# EasyEDA Pro project 2230506226.epro

# Schematic Schematic2
Board Name: Board1; Create Date: 2024-11-21; Page Name: P1; Project Name: 16V2_EDA; Schematic Name: Schematic2; Update Date: 2024-11-22; Company: 嘉立创EDA; Page Size: A4; Version: V1.0
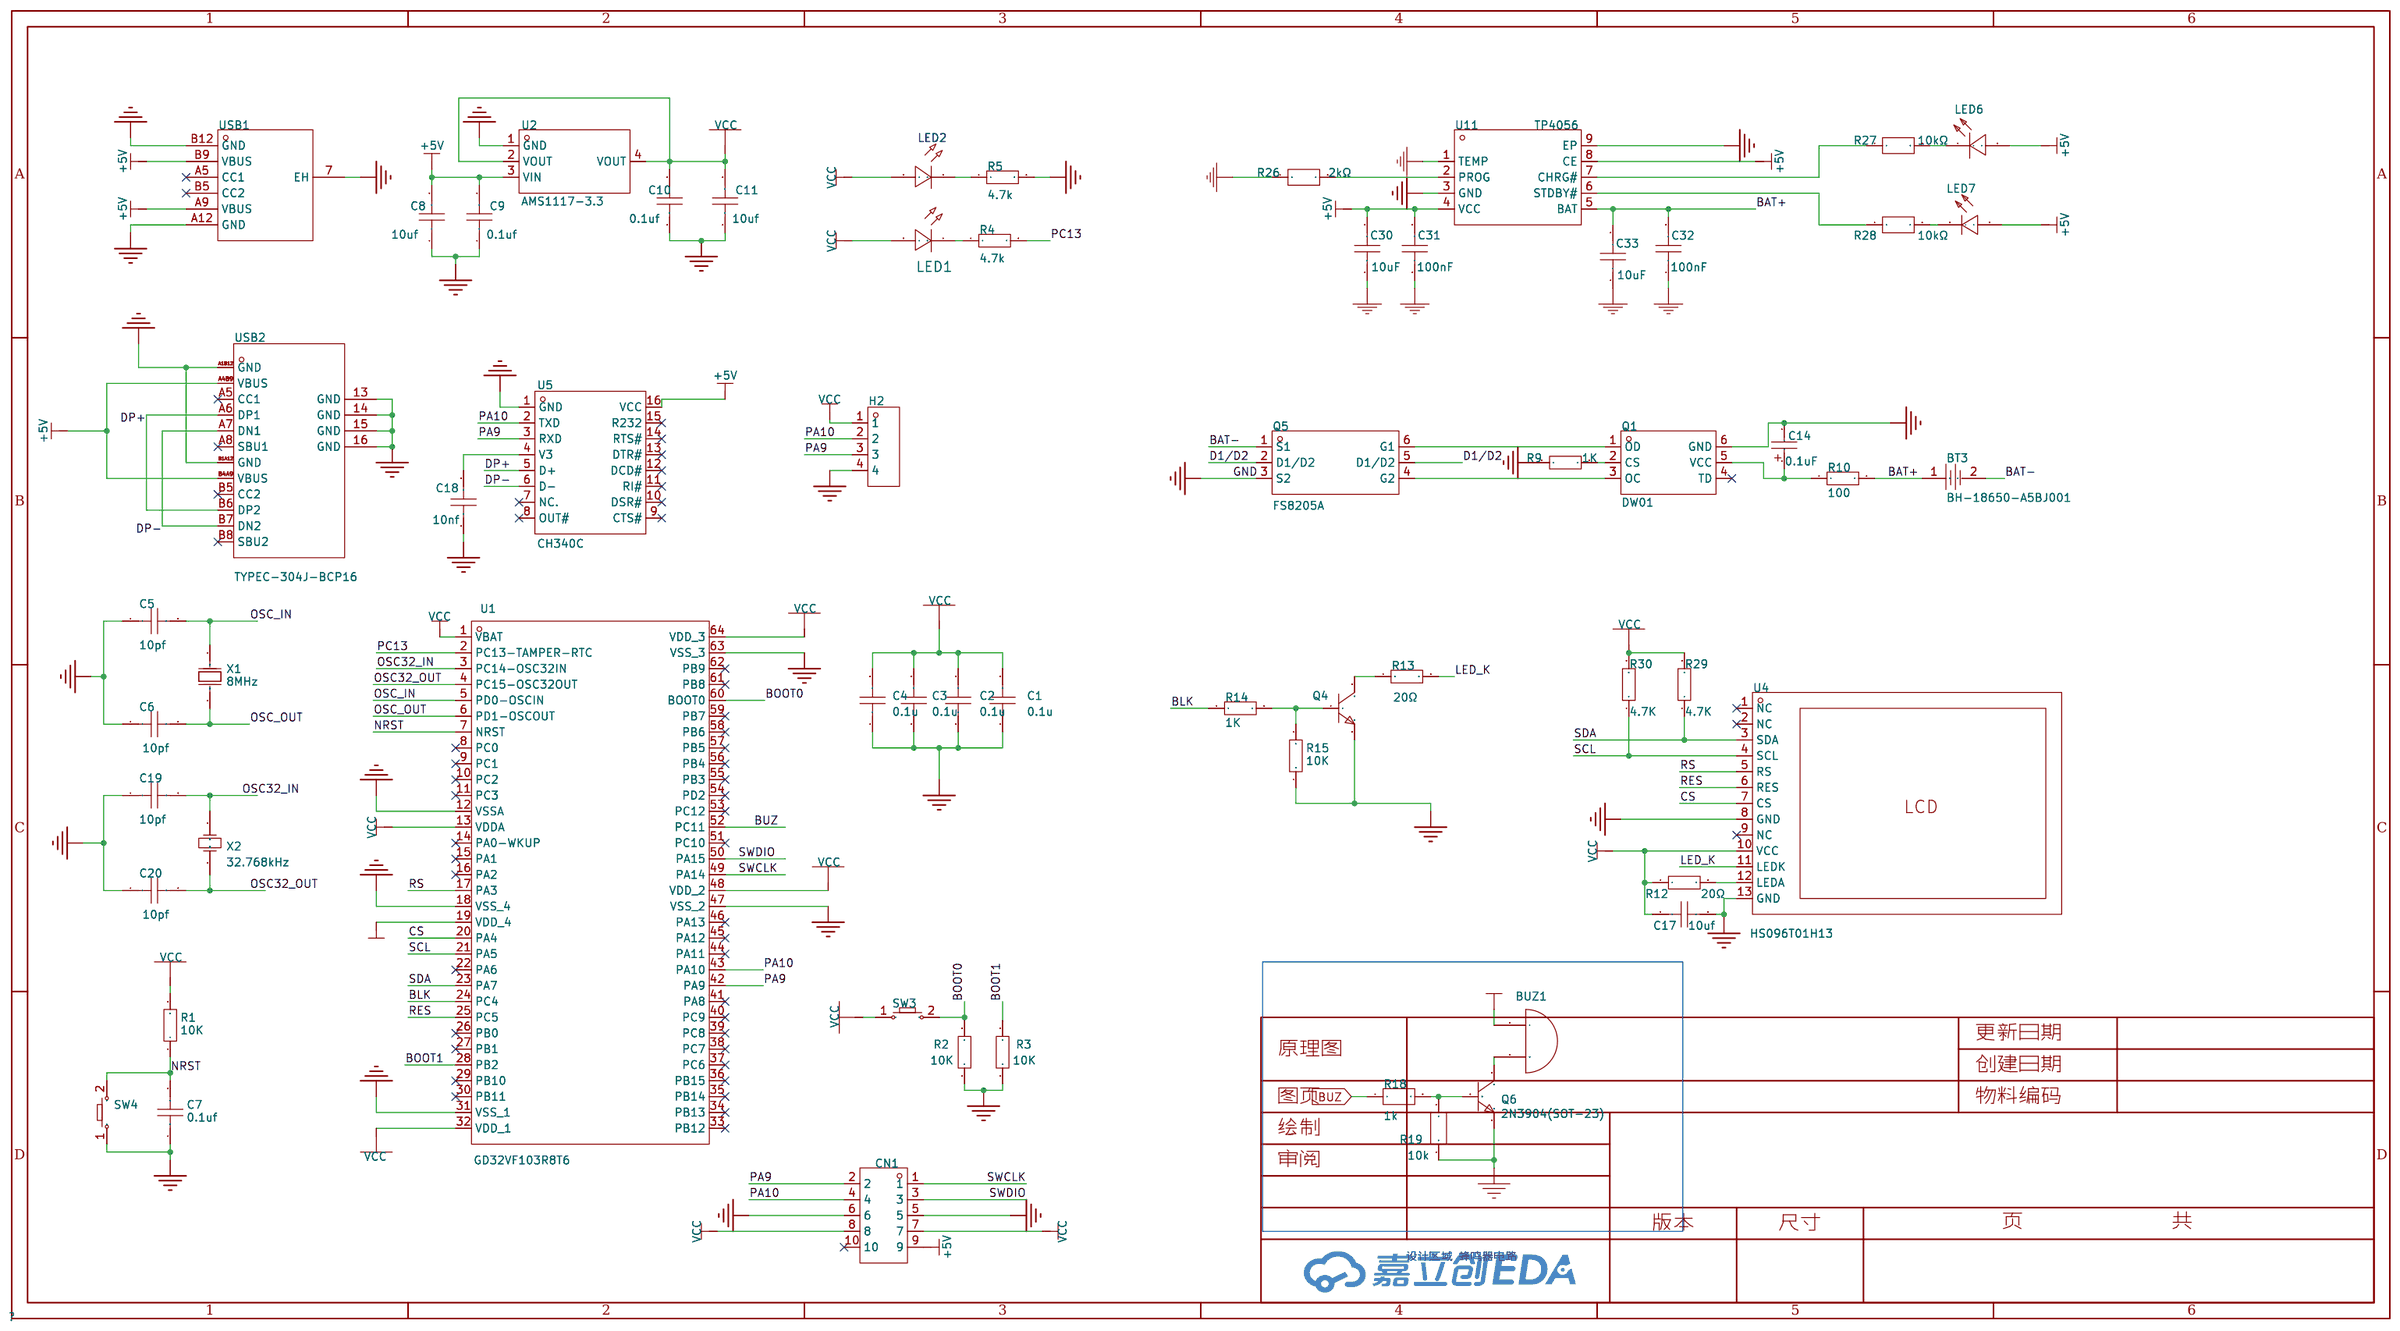
[diagram p0: schematic sheet]

## Parts
BT3  BH-18650-A5BJ001  [BAT-SMD_CR1202]
BUZ1  BUZ1  [BUZ]
C1  0.1u  [C0603]
C2  0.1u  [C0603]
C3  0.1u  [C0603]
C4  0.1u  [C0603]
C5  10pf  [C0603]
C6  10pf  [C0603]
C7  0.1uf  [C0603]
C8  10uf  [C0603]
C9  0.1uf  [C0603]
C10  0.1uf  [C0603]
C11  10uf  [C0603]
C14  0.1uF  [C0603]
C17  10uf  [C0603]
C18  10nf  [C0603]
C19  10pf  [C0603]
C20  10pf  [C0603]
C30  10uF  [C0603]
C31  100nF  [C0603]
C32  100nF  [C0603]
C33  10uF  [C0603]
CN1  ZX-PZ2.54-2-5PZZ  [hdr-th_10p-p2.54-v-m-r2-c5-s2.54]
H2  2.54-1*4P反弯排针  [HDR-TH_4P-P2.54-H-M-W10.4]
LED1  -  [LED_0603]
LED2  -  [LED_0603]
LED6  KT-0603R  [LED0603-RD]
LED7  NCD0603B1  [LED0603-RD]
Q1  DW01  [SOT-23-6_L2.9-W1.6-P0.95-LS2.8-BR]
Q4  -  [S8050_SOT-23]
Q5  FS8205A  [SOT-23-6_L2.9-W1.6-P0.95-LS2.8-BR]
Q6  2N3904(SOT-23)  [sot-23-3_l2.9-w1.3-p1.90-ls2.4-br]
R1  10K  [R0603]
R2  10K  [R0603]
R3  10K  [R0603]
R4  4.7k  [R0603]
R5  4.7k  [R0603]
R9  1K  [R0603]
R10  100  [R0603]
R12  20Ω  [R0603]
R13  20Ω  [R0603]
R14  1K  [R0603]
R15  10K  [R0603]
R18  1k  [R0603]
R19  10k  [R0603]
R26  2kΩ  [R0603]
R27  10kΩ  [R0603]
R28  10kΩ  [R0603]
R29  4.7K  [R0603]
R30  4.7K  [R0603]
SW3  -  [Key_SMD_3x4x2]
SW4  -  [Key_SMD_3x4x2]
U1  GD32VF103R8T6  [LQFP-64_L10.0-W10.0-P0.50-LS12.0-BL]
U2  AMS1117-3.3  [SOT-223-3_L6.5-W3.4-P2.30-LS7.0-BR]
U4  HS096T01H13  [LCD-SMD_HS096T01H13]
U5  CH340C  [SOP-16_L10.0-W3.9-P1.27-LS6.0-BL]
U11  TP4056  [esop-8_l4.9-w3.9-p1.27-ls6.0-bl-ep]
USB1  TYPE-C 6P  [TYPE-C-SMD_TYPE-C-6P]
USB2  TYPEC-304J-BCP16  [USB-C-SMD_TYPEC-304J-BCP16]
X1  8MHz  [HC-49S_L10.8-W4.5-P4.88]
X2  32.768kHz  [CRYSTAL-SMD_L3.2-W1.5]

## Library data of the parts
BT3 = BH-18650-A5BJ001: BHNi DIP 适用电池18650电芯//电池底座/卧式DIP 电池盒/电池座 材质：PP  镀镍 ，; Supplier Part: C5383220; Manufacturer: MYOUNG(美阳); Supplier Footprint: 插件; Datasheet: https://atta.szlcsc.com/upload/public/pdf/source/20230321/F45C04DF2D4E00D187312CBE97BD9F67.pdf; Supplier: LCSC
BUZ1 = BUZ1
C1-C11 C17-C20 = CAP_0603: Supplier Footprint: 0603
C14 = C_Ele_SMD_3x5.4mm: Supplier Footprint: SMD,3x5.4mm
C30 C33 = CL21A106KAYNNNE_C15850: 容值:10uF;精度:±10%;额定电压:25V;材质(温度系数):X5R;; LCSC Part Name: 10uF ±10% 25V; Supplier Part: C15850; Manufacturer: SAMSUNG(三星); Manufacturer Part: CL21A106KAYNNNE; Supplier Footprint: 0805; JLCPCB Part Class: Basic Part; Datasheet: https://atta.szlcsc.com/upload/public/pdf/source/20160218/1457707763339.pdf; Supplier: LCSC; Tolerance: ±10%; Voltage Rated: 25V; Temperature Coefficient: X5R
C31 C32 = CC0603KRX7R9BB104: 容值:100nF;精度:±10%;额定电压:50V;材质(温度系数):X7R;; LCSC Part Name: 100nF ±10% 50V; Supplier Part: C14663; Manufacturer: YAGEO(国巨); Supplier Footprint: 0603; JLCPCB Part Class: 基础库; Datasheet: https://atta.szlcsc.com/upload/public/pdf/source/20180910/C282072_33301C7F631E79921B82A8DAC6BCC5B3.pdf; Supplier: LCSC; Tolerance: ±10%; Voltage Rated: 50V; Temperature Coefficient: X7R
CN1 = ZX-PZ2.54-2-5PZZ: 插针结构:2x5P;间距:2.54mm;行距:2.54mm;圆针/方针:方针;安装类型:直插;排数:双排;总PIN位数:10P;额定电流:3A;额定电压:1kV;配合针长度:6mm;塑高:2.5mm;端接针长度:3mm;触头材质:黄铜;触头镀层:金;工作温度范围:-40℃~+105℃;焊接温度(最大值):-;颜色:黑色;; LCSC Part Name: 2x5P 间距:2.54mm 方针 直插; Supplier Part: C7501276; Manufacturer: Megastar(兆星); Supplier Footprint: 插件,P=2.54mm; JLCPCB Part Class: Extended Part; Datasheet: https://atta.szlcsc.com/upload/public/pdf/source/20231122/7DD2FA5A7FDBC10CDDB6051CB6BC6AD1.pdf; Supplier: LCSC; Pin Structure: 2x5P; Pitch: 2.54mm; Row Spacing: 2.54mm; Circluar Pins/Square Pins: 方针; Mounting Type: 直插; Number of Rows: 双排; Number of Pins: 10P; Current Rating (Max): 3A; Voltage Rating (Max): 1kV; Length of Mating Pin: 6mm; Insulation Height: 2.5mm; Length of End Connection Pin: 3mm; Contact Material: 黄铜; Contact Plating: 金; Operating Temperature Range: -40℃~+105℃; Color: 黑色; Check: false
H2 = 2.54-1*4P反弯排针: 插针结构:1x4P;间距:2.54mm;行距:-;圆针/方针:方针;安装类型:弯插;排数:单排;总PIN位数:4P;额定电流:3A;额定电压:-;配合针长度:6mm;塑高:-;端接针长度:-;触头材质:-;触头镀层:-;工作温度范围:-55℃~+105℃;颜色:黑色;; LCSC Part Name: 间距:2.54mm 1x4P 弯插 方针; Supplier Part: C91552; Manufacturer: BOOMELE(博穆精密); Supplier Footprint: 弯插,P=2.54mm; JLCPCB Part Class: 扩展库; Datasheet: https://atta.szlcsc.com/upload/public/pdf/source/20190508/C74252_03DDEC4696EE17172E44B96636392962.pdf; Supplier: LCSC; Pin Structure: 1x4P; Pitch: 2.54mm; Circluar Pins/Square Pins: 方针; Mounting Type: 弯插; Number of Rows: 单排; Number of Pins: 4P; Current Rating (Max): 3A; Length of Mating Pin: 6mm; Operating Temperature Range: -55℃~+105℃; Color: 黑色
LED1 = LED_0603-R: Supplier Footprint: 0603
LED2 = LED_0603-G: Supplier Footprint: 0603
LED6 = KT-0603R: Supplier: LCSC; Manufacturer: KENTO; Supplier Part: C2286; JLCPCB Part Class: Basic Part
LED7 = NCD0603B1: 发光颜色:蓝色;正向电压(VF):2.6V~3.6V;功率:72mW;正向电流:10mA;主波长:463nm~475nm;透镜颜色:无色透明透镜;发光强度:80mcd~220mcd;发光角度:130°;工作温度:-30℃~+85℃;; Supplier Part: C84266; Manufacturer: 国星光电; Supplier Footprint: 0603; JLCPCB Part Class: Extended Part; Datasheet: https://atta.szlcsc.com/upload/public/pdf/source/20200820/C84266_6A3CDBEFA72C6CAD68EDA53474ADAE6C.pdf; Supplier: LCSC; Emitted Color: 蓝色; Forward Voltage (VF): 2.6V~3.6V; Power Dissipation: 72mW; Forward Current: 10mA; Dominant Wavelength: 463nm~475nm; Lens Color: 无色透明透镜; Luminous Intensity: 80mcd~220mcd; Viewing Angle: 130°; Operating Temperature: -30℃~+85℃
Q1 = DW01_C181096: Supplier Part: C181096; Manufacturer: Hottech(合科泰); Supplier Footprint: SOT-23-6; Datasheet: https://atta.szlcsc.com/upload/public/pdf/source/20231007/94AC323C2B651AEA18C7FC8F0156E5A9.pdf; Supplier: LCSC
Q4 = S8050_SOT_NPN: Supplier Footprint: SOT-23
Q5 = FS8205A: 类型:2个N沟道;漏源电压(Vdss):20V;连续漏极电流(Id):6A;功率(Pd):1.5W;导通电阻(RDS(on)@Vgs,Id):19.5mΩ@4.5V,3A;阈值电压(Vgs(th)@Id):700mV@250uA;; LCSC Part Name: 2个N沟道 耐压:20V 电流:6A; Supplier Part: C2830320; Manufacturer: TECH PUBLIC(台舟); Supplier Footprint: SOT-23-6; JLCPCB Part Class: 扩展库; Datasheet: https://atta.szlcsc.com/upload/public/pdf/source/20210810/F53B6D4E8755A1F8E11BAF814CE98E6A.pdf; Supplier: LCSC; Type: 2个N沟道; Drain Source Voltage (Vdss): 20V; Continuous Drain Current (Id): 6A; Power Dissipation (Pd): 1.5W; Drain Source On Resistance (RDS(on)@Vgs,Id): 19.5mΩ@4.5V,3A; Gate Threshold Voltage (Vgs(th)@Id): 700mV@250uA; Total Gate Charge (Qg@Vgs): 5.7nC@10V; Input Capacitance (Ciss@Vds): 466pF@10V; Reverse Transfer Capacitance (Crss@Vds): 58pF@10V; Operating Temperature: -55℃~+150℃@(Tj)
Q6 = 2n3904S-RTK/PS: Supplier: LCSC; Manufacturer: KEC; Supplier Part: C18536; Paste Type: SOT-23
R1-R5 R9 R10 R12-R15 R29 R30 = Res_0603: Supplier Footprint: 0603
R18 = 1k
R19 = 10k
R26 = 0603WAF2001T5E: 电阻类型:厚膜电阻;阻值:2kΩ;精度:±1%;功率:100mW;最大工作电压:75V;温度系数:±100ppm/℃;; LCSC Part Name: 2kΩ ±1% 100mW 厚膜电阻; Supplier Part: C22975; Manufacturer: UNI-ROYAL(厚声); Supplier Footprint: 0603; JLCPCB Part Class: Basic Part; Datasheet: https://atta.szlcsc.com/upload/public/pdf/source/20200306/C422600_1E6D84923E4A46A82E41ADD87F860B5C.pdf; Supplier: LCSC; Type: 厚膜电阻; Tolerance: ±1%; Power(Watts): 100mW; Overload Voltage (Max): 75V; Temperature Coefficient: ±100ppm/℃; Operating Temperature Range: -55℃~+155℃
R27 R28 = 0603WAF1002T5E: 电阻类型:厚膜电阻;阻值:10kΩ;精度:±1%;功率:100mW;最大工作电压:75V;温度系数:±100ppm/℃;; LCSC Part Name: 厚膜电阻 10kΩ ±1% 100mW; Supplier Part: C25804; Manufacturer: UNI-ROYAL(厚声); Supplier Footprint: 0603; JLCPCB Part Class: Basic Part; Datasheet: https://atta.szlcsc.com/upload/public/pdf/source/20200306/C422600_1E6D84923E4A46A82E41ADD87F860B5C.pdf; Supplier: LCSC; Type: 厚膜电阻; Tolerance: ±1%; Power(Watts): 100mW; Overload Voltage (Max): 75V; Temperature Coefficient: ±100ppm/℃; Operating Temperature Range: -55℃~+155℃
SW3 SW4 = Key_SMD_3x4x2: Supplier Footprint: SMD
U1 = GD32VF103R8T6: CPU内核:RISC-V;程序存储容量:64KB;RAM总容量:20KB;GPIO端口数量:51;工作电压范围:-;CPU最大主频:108MHz;程序存储器类型:FLASH;; Supplier Part: C5178402; Manufacturer: GigaDevice(兆易创新); Supplier Footprint: LQFP-64(10x10); Supplier: LCSC; CPU Core: RISC-V; Program Storage Size: 64KB; RAM Size: 20KB; GPIO Ports Number: 51; CPU Maximum Speed: 108MHz; Program Memory Type: FLASH; ADC (Bit): 12bit; DAC (Bit): 12bit; 16Bit Timer: 7; CAN: 2; UART/USART: 5; I2C: 2; I2S: 2; SPI: 3; Universal Serial Bus: 有; Peripheral/Function: 看门狗；RTC实时时钟; Watchdog: 有; Real-Time Clock: 有
U2 = AMS1117-3.3_C6186: 输出类型:固定;最大输入电压:-;输出电压:3.3V;最大输出电流:1A;电源纹波抑制比(PSRR):72dB@(120Hz);输出极性:正极;; LCSC Part Name: 输出3.3V 1A; Supplier Part: C6186; Manufacturer: AMS; Supplier Footprint: SOT-223; JLCPCB Part Class: 基础库; Datasheet: https://atta.szlcsc.com/upload/public/pdf/source/20180727/C6186_7A095716F0823C02F1997A905E26C086.pdf; Supplier: LCSC; Output Type: 固定; Output Voltage: 3.3V; MAX Output Current: 1A; Power Supply Rejection Ratio (PSRR): 72dB@(120Hz); Dropout Voltage: 1.3V@(800mA); Output Polarity: 正极; Number of Outputs: 1
U4 = HS096T01H13: 主控芯片:ST7735;尺寸(inch):0.96;; LCSC Part Name: 0.96寸 0.96寸800x160(RGB)彩色SPI串口TFT液晶显示屏; Supplier Part: C18198246; Manufacturer: HS(汉昇); Datasheet: https://atta.szlcsc.com/upload/public/pdf/source/20230921/67AD52EDFD5E8BFFA1AE424F3A3F761A.pdf; Supplier: LCSC; Main Control Chip: ST7735; Size: 0.96; Operating Temperature: -20℃~+70℃
U5 = CH340C: 应用功能:收发器;接口协议:USB 2.0;数据速率:2Mbps;; LCSC Part Name: CH340C USB转串口芯片 CH340; Supplier Part: C84681; Manufacturer: WCH(南京沁恒); Supplier Footprint: SOP-16; JLCPCB Part Class: 扩展库; Datasheet: https://atta.szlcsc.com/upload/public/pdf/source/20200819/C84681_ADBED554CE321879DBD6B1D06488689C.pdf; Supplier: LCSC; Applications Function: 收发器; Protocol: USB 2.0; Supply Voltage: 3.3V；5V; Data Rate: 2Mbps
U11 = TP4056_C725790: Supplier: LCSC; Supplier Part: C725790; Manufacturer: UMW(友台半导体); JLCPCB Part Class: Extended Part
USB1 = TYPE-C 6P: 连接器类型:Type-C;标准:-;公母:母;端口数量:1;触点数量:6P;安装方式:卧贴;额定电流 - 电源:-;工作温度范围:-40℃~+85℃;; LCSC Part Name: Type-C 母 卧贴; Supplier Part: C456012; Manufacturer: SHOU HAN(首韩); Supplier Footprint: SMD; JLCPCB Part Class: 扩展库; Datasheet: https://atta.szlcsc.com/upload/public/pdf/source/20201203/C456012_B13F72044DF846EDBE9BDD0D1D3CD166.pdf; Supplier: LCSC; Connector Type: Type-C; Gender: 母; Number of Ports: 1; Number of Contacts: 6P; Mounting Style: 卧贴; Operating Temperature Range: -40℃~+85℃
USB2 = TYPEC-304J-BCP16: 连接器类型:Type-C;标准:USB 3.1;公母:母;端口数量:1;触点数量:16P;安装方式:卧贴;额定电流 - 电源:5A;工作温度范围:-40℃~+85℃;焊接温度(最大值):260℃;; LCSC Part Name: Type-C 母 卧贴; Supplier Part: C2835315; Manufacturer: XUNPU(讯普); Supplier Footprint: SMD; Datasheet: https://atta.szlcsc.com/upload/public/pdf/source/20210528/C2835315_A76BD3CF9329D12B6041421AD23BFD66.pdf; Supplier: LCSC; Connector Type: Type-C; Standard: USB 3.1; Gender: 母; Number of Ports: 1; Number of Contacts: 16P; Mounting Style: 卧贴; Current Rating - Power (Max): 5A; Operating Temperature Range: -40℃~+85℃; Soldering Temperature(Max): 260℃
X1 = X49SM8MSD2SC: 晶振类型:贴片晶振;频率:8MHz;常温频差:±20ppm;外接负载电容:20pF;频率稳定度(全温):±30ppm;; LCSC Part Name: 8MHz ±20ppm 20pF; Supplier Part: C12674; Manufacturer: YXC(扬兴晶振); Supplier Footprint: HC-49S-SMD; JLCPCB Part Class: 基础库; Datasheet: https://atta.szlcsc.com/upload/public/pdf/source/20240329/3EBF42EBCAB50CA65B6FA9D7CFA1955A.pdf; Supplier: LCSC; Crystal Type: 贴片晶振; Normal temperature Frequency Tolerance: ±20ppm; External load capacitor: 20pF; Frequency Stability(Full temperature range): ±30ppm; Operating Temperature: -20℃~+70℃
X2 = X308032768KGB2SC: 晶振类型:直插晶振;频率:32.768kHz;常温频差:±10ppm;外接负载电容:12.5pF;频率稳定度(全温):-;; LCSC Part Name: 32.768kHz ±10ppm 12.5pF YT-38; Supplier Part: C52082; Manufacturer: YXC(扬兴晶振); Supplier Footprint: DT-38; JLCPCB Part Class: Extended Part; Datasheet: https://atta.szlcsc.com/upload/public/pdf/source/20240329/231E1A1EB7C875CD193DBE6664A3DE3A.pdf; Supplier: LCSC; Crystal Type: 直插晶振; Normal temperature Frequency Tolerance: ±10ppm; External load capacitor: 12.5pF; Operating Temperature: -20℃~+70℃

## Nets
+5V: C8.2 C9.2 C30.2 C31.2 CN1.9 LED6.2(A) LED7.2(+) U2.3(VIN) U5.16(VCC) U11.4(VCC) U11.8(CE) USB1.A9(VBUS) USB1.B9(VBUS) USB2.A4B9(VBUS) USB2.B4A9(VBUS)
GND: C1.1 C2.1 C3.1 C4.1 C5.1 C6.1 C7.1 C8.1 C9.1 C10.1 C11.1 C14.2 C17.2 C18.1 C19.1 C20.1 C30.1 C31.1 C32.1 C33.1 CN1.5 CN1.6 H2.4 Q1.6(GND) Q4.2 Q5.3(S2) Q6.1(E) R2.1 R3.1 R5.2 R9.1 R15.1 R19.2 R26.1 SW4.1 U1.12(VSSA) U1.18(VSS_4) U1.31(VSS_1) U1.47(VSS_2) U1.63(VSS_3) U2.1(GND) U4.8(GND) U4.13(GND) U5.1(GND) U11.1(TEMP) U11.3(GND) U11.9(EP) USB1.7(EH) USB1.A12(GND) USB1.B12(GND) USB2.13(GND) USB2.14(GND) USB2.15(GND) USB2.16(GND) USB2.A1B12(GND) USB2.B1A12(GND)
VCC: BUZ1.1(A) C1.2 C2.2 C3.2 C4.2 C10.2 C11.2 C17.1 CN1.7 CN1.8 H2.1 LED1.2(A) LED2.2(A) R1.2 R12.1 R29.2 R30.2 SW3.1 U1.1(VBAT) U1.13(VDDA) U1.19(VDD_4) U1.32(VDD_1) U1.48(VDD_2) U1.64(VDD_3) U2.2(VOUT) U2.4(VOUT) U4.10(VCC)
BAT+: BT3.1 C32.2 C33.2 R10.2 U11.5(BAT)
BAT-: BT3.2 Q5.1(S1)
BLK: R14.1 U1.24(PC4)
BOOT0: R2.2 SW3.2 U1.60(BOOT0)
BOOT1: R3.2 U1.28(PB2)
BUZ: R18.1 U1.52(PC11)
CS: U1.20(PA4) U4.7(CS)
D1/D2: Q5.2(D1/D2) Q5.5(D1/D2)
DP+: U5.5(D+) USB2.A6(DP1) USB2.B6(DP2)
DP-: U5.6(D-) USB2.A7(DN1) USB2.B7(DN2)
LED_K: R13.2 U4.11(LEDK)
NRST: C7.2 R1.1 SW4.2 U1.7(NRST)
OSC32_IN: C19.2 U1.3(PC14-OSC32IN) X2.1(OSC1)
OSC32_OUT: C20.2 U1.4(PC15-OSC32OUT) X2.2(OSC2)
OSC_IN: C5.2 U1.5(PD0-OSCIN) X1.1(OSC1)
OSC_OUT: C6.2 U1.6(PD1-OSCOUT) X1.2(OSC2)
PA9: CN1.2 H2.3 U1.42(PA9) U5.3(RXD)
PA10: CN1.4 H2.2 U1.43(PA10) U5.2(TXD)
PC13: R4.2 U1.2(PC13-TAMPER-RTC)
RES: U1.25(PC5) U4.6(RES)
RS: U1.17(PA3) U4.5(RS)
SCL: R30.1 U1.21(PA5) U4.4(SCL)
SDA: R29.1 U1.23(PA7) U4.3(SDA)
SWCLK: CN1.1 U1.49(PA14)
SWDIO: CN1.3 U1.50(PA15)
$1N3244: LED1.1(C) R4.1
$1N3260: LED2.1(C) R5.1
$1N3280: Q1.2(CS) R9.2
$1N3281: C14.1 Q1.5(VCC) R10.1
$1N3299: R12.2 U4.12(LEDA)
$1N3320: Q4.3 R13.1
$1N3321: Q4.1 R14.2 R15.2
$1N3342: C18.2 U5.4(V3)
$1N3364: R26.2 U11.2(PROG)
$1N3367: R27.1 U11.7(CHRG#)
$1N3368: LED6.1(K) R27.2
$1N3369: LED7.1(-) R28.2
$1N3370: R28.1 U11.6(STDBY#)
$1N3387: Q1.1(OD) Q5.6(G1)
$1N3388: Q1.3(OC) Q5.4(G2)
$1N22463: Q6.2(B) R18.2 R19.1
$1N22485: BUZ1.2(B) Q6.3(C)

Not connected (* = marked no-connect by the designer): CN1 10*; Q1 4(TD)*; U1 8(PC0)* 9(PC1)* 10(PC2)* 11(PC3)* 14(PA0-WKUP)* 15(PA1)* 16(PA2)* 22(PA6)* 26(PB0)* 27(PB1)* 29(PB10)* 30(PB11)* 33(PB12)* 34(PB13)* 35(PB14)* 36(PB15)* 37(PC6)* 38(PC7)* 39(PC8)* 40(PC9)* 41(PA8)* 44(PA11)* 45(PA12)* 46(PA13)* 51(PC10)* 53(PC12)* 54(PD2)* 55(PB3)* 56(PB4)* 57(PB5)* 58(PB6)* 59(PB7)* 61(PB8)* 62(PB9)*; U4 1(NC)* 2(NC)* 9(NC)*; U5 7(NC.)* 8(OUT#)* 9(CTS#)* 10(DSR#)* 11(RI#)* 12(DCD#)* 13(DTR#)* 14(RTS#)* 15(R232)*; USB1 A5(CC1)* B5(CC2)*; USB2 A5(CC1)* A8(SBU1)* B5(CC2)* B8(SBU2)*

## Notes on the sheet
- 设计区域 蜂鸣器电路

# Board PCB
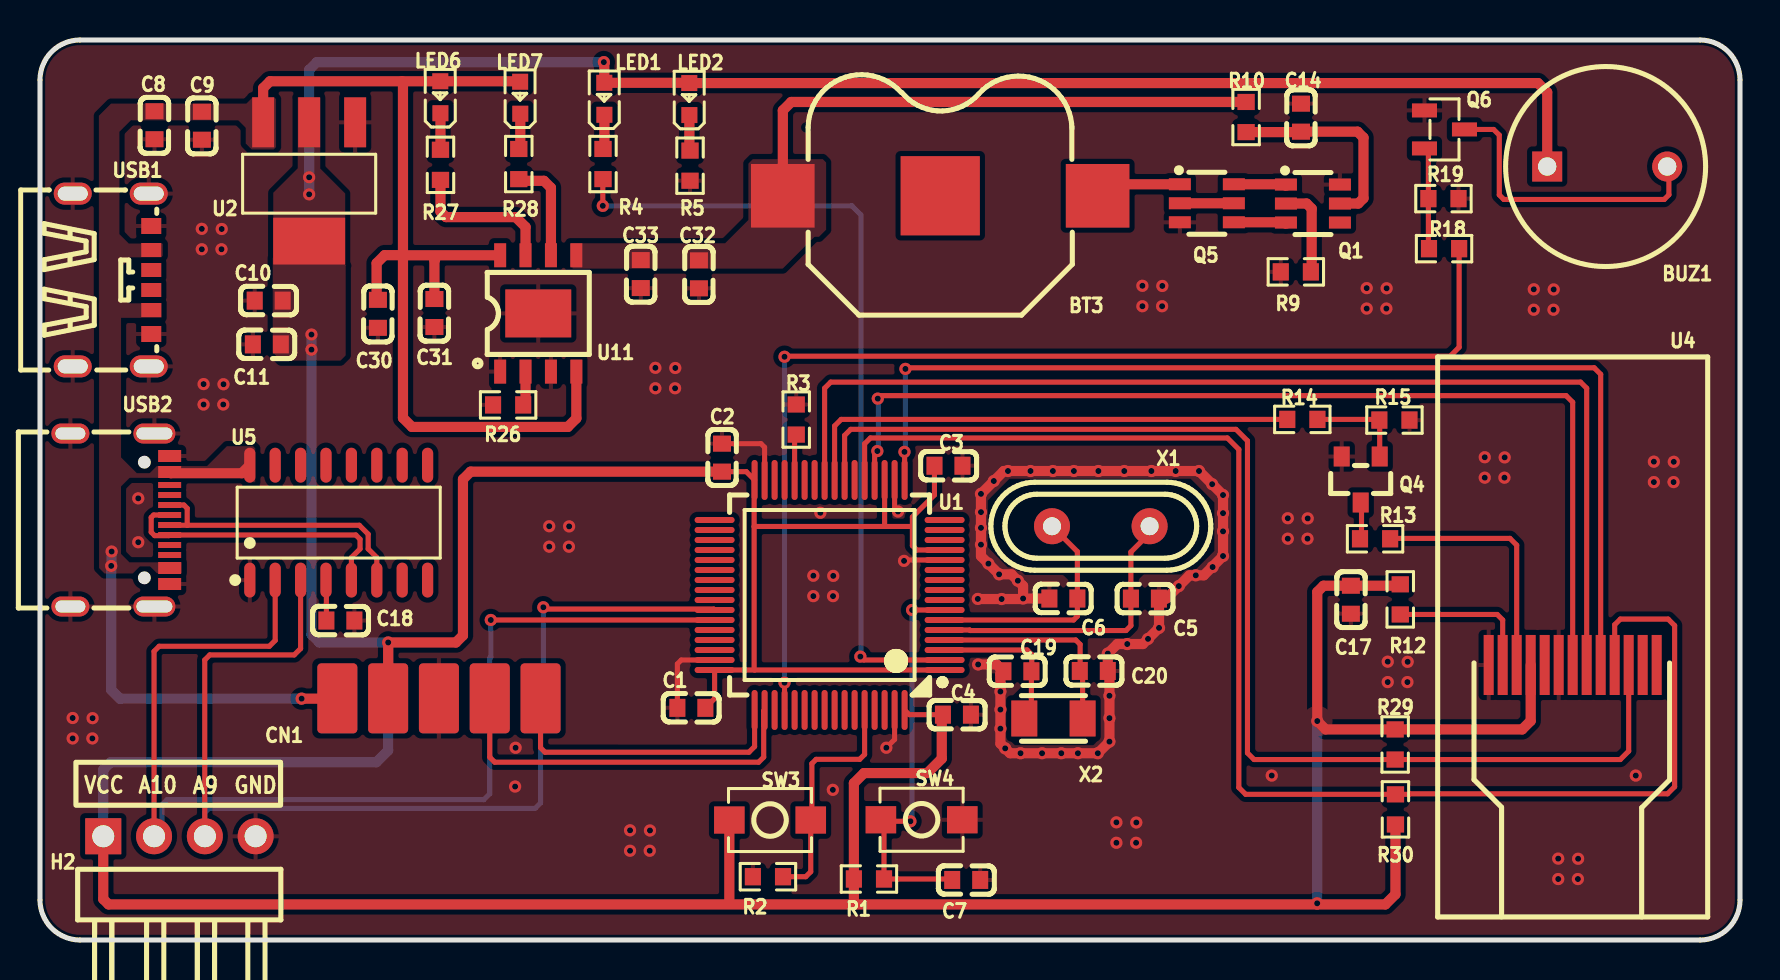
[diagram p1: board, top side]
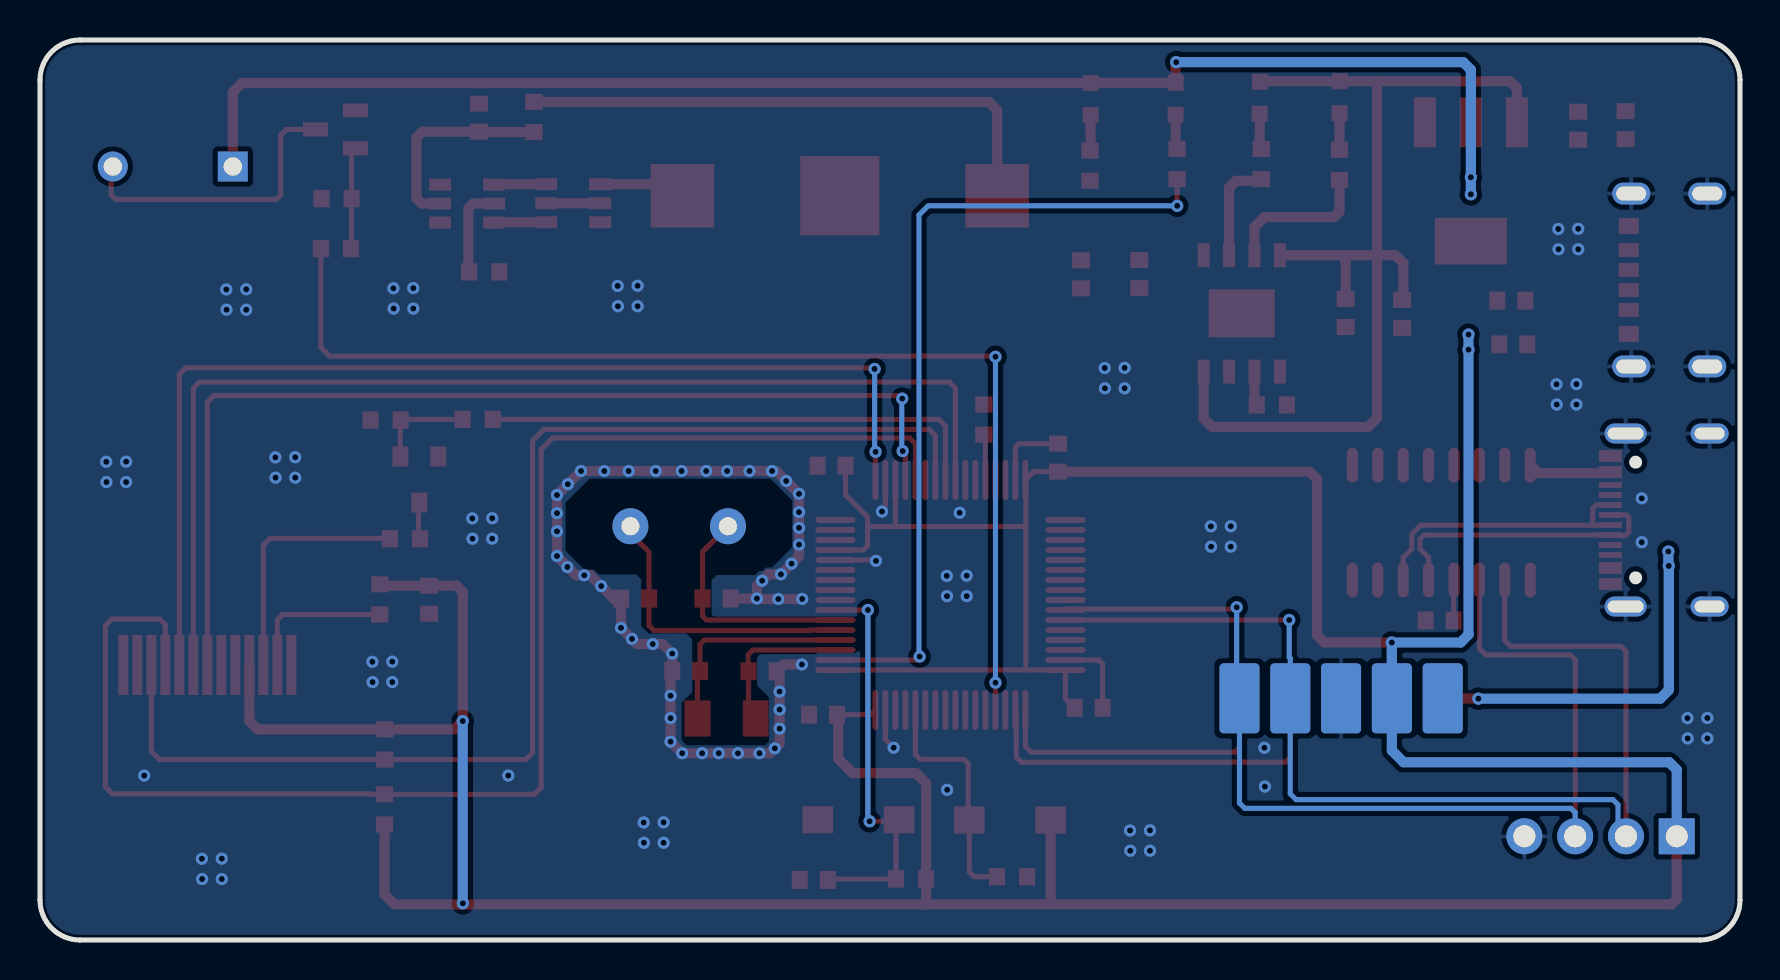
[diagram p2: board, bottom side, seen from below]

Outline 85 x 45 mm; copper layers: Top Layer, Bottom Layer. Coordinates in mm from the lower left corner of the outline.
Outline path: 0,43 0,2 arc(0.59,0.59) 2,0 83,0 arc(84.41,0.59) 85,2 85,43 arc(84.41,44.41) 83,45 2,45 arc(0.59,44.41) 0,43
Stack: Top Layer 0.035mm / Dielectric1 1.51mm FR4 er 4.5 / Bottom Layer 0.035mm

## Design rules (mm)
net DP+: usb
net DP-: usb
template: 自定义配置
spacing copperThickness1oz (default): track to track 0.178, other pairs 0.152 to 0.203
spacing copperThickness2oz: track to track 0.203, other pairs 0.152 to 0.3
track width copperThickness1oz (default): min 0.254, default 0.254, max 2.54
track width pwr: min 0.254, default 0.508, max 2.54
differential pair differentialPair (default): width min 0.127, default 0.254, max 2.54; gap min 0.152, default 0.152
via viaSize (default): diameter min 0.61, default 0.61, max 10; hole min 0.305, default 0.305, max 6.299
net BAT- uses pwr
net BAT+ uses pwr
net VCC uses pwr
net GND uses pwr
net +5V uses pwr

## Placement (name value [footprint] x y rotation side)
BT3  BH-18650-A5BJ001  [BAT-SMD_CR1202]  45.01 37.21 0 top
BUZ1  BUZ1  [BUZ]  78.28 35.5 0 top
C1  0.1u  [C0603]  32.57 11.61 0 top
C2  0.1u  [C0603]  34.1 24.12 270 top
C3  0.1u  [C0603]  45.42 23.71 180 top
C4  0.1u  [C0603]  45.85 11.27 180 top
C5  10pf  [C0603]  55.25 17.07 180 top
C6  10pf  [C0603]  51.17 17.07 0 top
C7  0.1uf  [C0603]  46.31 3 180 top
C8  10uf  [C0603]  5.72 40.74 90 top
C9  0.1uf  [C0603]  8.09 40.71 90 top
C10  0.1uf  [C0603]  11.44 31.97 0 top
C11  10uf  [C0603]  11.34 29.78 0 top
C14  0.1uF  [C0603]  63.05 41.12 90 top
C17  10uf  [C0603]  65.54 17.01 270 top
C18  10nf  [C0603]  15.02 15.97 180 top
C19  10pf  [C0603]  48.87 13.44 0 top
C20  10pf  [C0603]  52.69 13.45 180 top
C30  10uF  [C0603]  16.89 31.31 90 top
C31  100nF  [C0603]  19.72 31.35 90 top
C32  100nF  [C0603]  32.95 33.28 90 top
C33  10uF  [C0603]  30.04 33.3 90 top
CN1  ZX-PZ2.54-2-5PZZ  [hdr-th_10p-p2.54-v-m-r2-c5-s2.54]  19.95 5.25 0 top
H2  2.54-1*4P反弯排针  [HDR-TH_4P-P2.54-H-M-W10.4]  6.97 5.19 0 top
LED1  -  [LED_0603]  28.21 42.11 90 top
LED2  -  [LED_0603]  32.46 42.1 90 top
LED6  KT-0603R  [LED0603-RD]  20.02 42.14 90 top
LED7  NCD0603B1  [LED0603-RD]  24.01 42.11 90 top
Q1  DW01  [SOT-23-6_L2.9-W1.6-P0.95-LS2.8-BR]  63.65 36.82 180 top
Q4  -  [S8050_SOT-23]  66.16 23.03 90 top
Q5  FS8205A  [SOT-23-6_L2.9-W1.6-P0.95-LS2.8-BR]  58.34 36.84 180 top
Q6  2N3904(SOT-23)  [sot-23-3_l2.9-w1.3-p1.90-ls2.4-br]  70.22 40.53 180 top
R1  10K  [R0603]  41.45 3.05 180 top
R2  10K  [R0603]  36.4 3.17 0 top
R3  10K  [R0603]  37.81 26.02 270 top
R4  4.7k  [R0603]  28.15 38.8 270 top
R5  4.7k  [R0603]  32.5 38.72 270 top
R9  1K  [R0603]  62.79 33.41 0 top
R10  100  [R0603]  60.3 41.15 90 top
R12  20Ω  [R0603]  68.01 17.03 270 top
R13  20Ω  [R0603]  66.75 20.06 0 top
R14  1K  [R0603]  63.12 26.03 0 top
R15  10K  [R0603]  67.72 26 180 top
R18  1k  [R0603]  70.2 34.57 180 top
R19  10k  [R0603]  70.17 37.07 0 top
R26  2kΩ  [R0603]  23.41 26.75 0 top
R27  10kΩ  [R0603]  20.02 38.76 90 top
R28  10kΩ  [R0603]  23.94 38.8 90 top
R29  4.7K  [R0603]  67.76 9.78 90 top
R30  4.7K  [R0603]  67.77 6.53 270 top
SW3  -  [Key_SMD_3x4x2]  36.5 6 0 top
SW4  -  [Key_SMD_3x4x2]  44.08 6.01 180 top
U1  GD32VF103R8T6  [LQFP-64_L10.0-W10.0-P0.50-LS12.0-BL]  39.48 17.25 90 top
U2  AMS1117-3.3  [SOT-223-3_L6.5-W3.4-P2.30-LS7.0-BR]  13.46 37.91 90 top
U4  HS096T01H13  [LCD-SMD_HS096T01H13]  76.63 13.75 270 top
U5  CH340C  [SOP-16_L10.0-W3.9-P1.27-LS6.0-BL]  14.94 20.87 0 top
U11  TP4056  [esop-8_l4.9-w3.9-p1.27-ls6.0-bl-ep]  24.91 31.33 0 top
USB1  TYPE-C 6P  [TYPE-C-SMD_TYPE-C-6P]  3.6 33 270 top
USB2  TYPEC-304J-BCP16  [USB-C-SMD_TYPEC-304J-BCP16]  4 21 270 top
X1  8MHz  [HC-49S_L10.8-W4.5-P4.88]  53.04 20.69 180 top
X2  32.768kHz  [CRYSTAL-SMD_L3.2-W1.5]  50.67 11.08 0 top

## Footprints (pads in the part's own frame, mm; a bottom-side part is the same pattern mirrored in y, then rotated)
BAT-SMD_CR1202
  rect 3.18x3.18 smd: 1(-7.87,0) 2(7.87,0)
  rect 3.96x3.96 smd: 3(0,0)
BUZ
  rect 1.5x1.5 hole 0.914: 1(-2.921,3.175)
  round 1.5 hole 0.914: 2(3.079,3.175)
C0603
  rect 0.8x0.9 smd: 1(-0.7,0) 2(0.7,0)
CRYSTAL-SMD_L3.2-W1.5
  rect 1.3x1.8 smd: 1(-1.458,0) 2(1.458,0)
esop-8_l4.9-w3.9-p1.27-ls6.0-bl-ep
  rect 0.6x1.2 smd: 1(-1.905,-2.909) 2(-0.635,-2.909) 3(0.635,-2.909) 4(1.905,-2.909) 5(1.905,2.909) 6(0.635,2.909) 7(-0.635,2.909) 8(-1.905,2.909)
  rect 3.3x2.4 smd: 9(0,0)
HC-49S_L10.8-W4.5-P4.88
  round 1.8 hole 0.9: 1(-2.44,0) 2(2.44,0)
HDR-TH_4P-P2.54-H-M-W10.4
  rect 1.8x1.8 hole 1.1: 1(-3.81,0)
  round 1.8 hole 1.1: 2(-1.27,0) 3(1.27,0) 4(3.81,0)
hdr-th_10p-p2.54-v-m-r2-c5-s2.54
  rrect 2x3.5 smd: 1(5.08,6.832) 3(2.54,6.832) 5(0,6.832) 7(-2.54,6.832) 9(-5.08,6.832)
  rrect 2x3.5 smd far side: 2(5.08,6.832) 4(2.54,6.832) 6(0,6.832) 8(-2.54,6.832) 10(-5.08,6.832)
Key_SMD_3x4x2
  rect 1.53x1.36 smd: 1(-2.035,0) 2(2.035,0)
LCD-SMD_HS096T01H13
  rect 3x0.5 smd: 1(0,4.2) 2(0,3.5) 3(0,2.8) 4(0,2.1) 5(0,1.4) 6(0,0.7) 7(0,0) 8(0,-0.7) 9(0,-1.4) 10(0,-2.1) 11(0,-2.8) 12(0,-3.5) 13(0,-4.2)
LED0603-RD
  rect 0.8x0.8 smd: 1(-0.799,-0.004) 2(0.799,0.004)
LED_0603
  rect 0.8x0.8 smd: 1(-0.851,-0.01) 2(0.75,-0.005)
LQFP-64_L10.0-W10.0-P0.50-LS12.0-BL
  oval 0.3x2 smd: 1(-3.75,-5.75) 2(-3.25,-5.75) 3(-2.75,-5.75) 4(-2.25,-5.75) 5(-1.75,-5.75) 6(-1.25,-5.75) 7(-0.75,-5.75) 8(-0.25,-5.75) 9(0.25,-5.75) 10(0.75,-5.75) 11(1.25,-5.75) 12(1.75,-5.75) 13(2.25,-5.75) 14(2.75,-5.75) 15(3.25,-5.75) 16(3.75,-5.75) 33(3.75,5.75) 34(3.25,5.75) 35(2.75,5.75) 36(2.25,5.75) 37(1.75,5.75) 38(1.25,5.75) 39(0.75,5.75) 40(0.25,5.75) 41(-0.25,5.75) 42(-0.75,5.75) 43(-1.25,5.75) 44(-1.75,5.75) 45(-2.25,5.75) 46(-2.75,5.75) 47(-3.25,5.75) 48(-3.75,5.75)
  oval 2x0.3 smd: 17(5.75,-3.75) 18(5.75,-3.25) 19(5.75,-2.75) 20(5.75,-2.25) 21(5.75,-1.75) 22(5.75,-1.25) 23(5.75,-0.75) 24(5.75,-0.25) 25(5.75,0.25) 26(5.75,0.75) 27(5.75,1.25) 28(5.75,1.75) 29(5.75,2.25) 30(5.75,2.75) 31(5.75,3.25) 32(5.75,3.75) 49(-5.75,3.75) 50(-5.75,3.25) 51(-5.75,2.75) 52(-5.75,2.25) 53(-5.75,1.75) 54(-5.75,1.25) 55(-5.75,0.75) 56(-5.75,0.25) 57(-5.75,-0.25) 58(-5.75,-0.75) 59(-5.75,-1.25) 60(-5.75,-1.75) 61(-5.75,-2.25) 62(-5.75,-2.75) 63(-5.75,-3.25) 64(-5.75,-3.75)
R0603
  rect 0.806x0.864 smd: 1(-0.753,0) 2(0.753,0)
S8050_SOT-23
  rect 1x0.8 smd: 1(1.15,-0.823) 2(1.15,1.077) 3(-1.15,0.127)
SOP-16_L10.0-W3.9-P1.27-LS6.0-BL
  oval 0.56x1.745 smd: 1(-4.445,-2.873) 2(-3.175,-2.873) 3(-1.905,-2.873) 4(-0.635,-2.873) 5(0.635,-2.873) 6(1.905,-2.873) 7(3.175,-2.873) 8(4.445,-2.873) 9(4.445,2.873) 10(3.175,2.873) 11(1.905,2.873) 12(0.635,2.873) 13(-0.635,2.873) 14(-1.905,2.873) 15(-3.175,2.873) 16(-4.445,2.873)
sot-23-3_l2.9-w1.3-p1.90-ls2.4-br
  rect 1.25x0.7 smd: 1(1,-0.95) 2(1,0.95) 3(-1,0)
SOT-23-6_L2.9-W1.6-P0.95-LS2.8-BR
  rect 1.1x0.6 smd: 1(1.35,-0.95) 2(1.35,0) 3(1.35,0.95) 4(-1.35,0.95) 5(-1.35,0) 6(-1.35,-0.95)
SOT-223-3_L6.5-W3.4-P2.30-LS7.0-BR
  rect 2.5x1.1 smd: 1(2.97,-2.3) 2(2.97,0) 3(2.97,2.3)
  rect 2.34x3.6 smd: 4(-2.97,0)
TYPE-C-SMD_TYPE-C-6P
  oval 1.1x1.9 hole 0.7x1.5: 7(-4.32,1.837) 7(-4.32,-1.962) 7(4.32,1.837) 7(4.32,-1.962)
  rect 0.7x1 smd: A5(-0.5,1.962) A9(1.5,1.962) B5(0.5,1.962) B9(-1.5,1.962)
  rect 0.8x1 smd: A12(2.7,1.962) B12(-2.7,1.962)
USB-C-SMD_TYPEC-304J-BCP16
  oval 1x2.1 hole 0.6x1.8: 13(-4.325,1.718) 14(4.325,1.718)
  oval 1x1.9 hole 0.6x1.5: 15(-4.325,-2.482) 16(4.325,-2.482)
  rect 0.6x1.15 smd: A1B12(-3.2,2.482) A4B9(-2.4,2.482) B1A12(3.2,2.482) B4A9(2.4,2.482)
  rect 0.3x1.15 smd: A5(-1.25,2.482) A6(-0.25,2.482) A7(0.25,2.482) A8(1.25,2.482) B5(1.75,2.482) B6(0.75,2.482) B7(-0.75,2.482) B8(-1.75,2.482)

## Nets
As in the schematic.

Pads without a net: BT3 3; CN1 10; Q1 4; U1 8 9 10 11 14 15 16 22 26 27 29 30 33 34 35 36 37 38 39 40 41 44 45 46 51 53 54 55 56 57 58 59 61 62; U4 1 2 9; U5 7 8 9 10 11 12 13 14 15; USB1 A5 B5; USB2 A5 A8 B5 B8

## Via types
v1: diameter 0.61, hole 0.305, Top Layer to Bottom Layer, 143 vias

## Routing (per net, layer and track width the routed paths; a pad name or vN(x,y) marks a point on that pad's centre or on a via; arc(x,y) is an arc through that point)
+5V: length 75.8
  Top Layer w0.508: 18.1,42.94 LED6.2 23.98,42.94 LED7.2 ; 18.1,42.94 11.5,42.94 11.16,42.59 U2.3 ; 18.1,42.94 18.15,42.89 18.15,34.3 ; 23.01,34.24 18.21,34.24 18.15,34.3 ; 18.15,34.3 18.15,26.11 18.6,25.65 26.39,25.65 26.82,26.08 U11.4 ; 18.15,34.3 18.09,34.24 17.23,34.24 16.83,33.84 16.83,32.07 C30.2 ; 19.76,34.02 19.72,33.98 C31.2 ; USB2.A4B9 6.54,23.34 10.09,23.34 U5.16 ; v1(13.08,12.07) 14.85,12.07 14.87,12.08
  Bottom Layer w0.508: v1(3.58,19.42) 3.58,18.72 v1(3.56,18.7) 3.56,12.5 3.99,12.07 v1(13.08,12.07)
GND: length 64
  Top Layer w0.254: C2.1 36.05,24.82 36.23,24.64 U1.31 ; U1.18 42.73,21.6 v1(42.9,21.42) ; U1.12 43.25,19 v1(43.2,18.96) ; v1(42.32,9.61) 42.73,10.03 U1.63 ; C1.1 31.87,13.8 32.06,14 U1.47
  Top Layer w0.508: C6.1 v1(49.15,17.07) ; v1(49.15,17.07) 49.13,17.05 v1(48.08,17.05) 46.9,17.05 v1(46.89,17.05) ; v1(49.15,17.07) 49.15,17.7 v1(48.89,17.96) 48.57,18.28 v1(47.96,18.28) v1(47.42,18.82) 47.05,19.19 v1(47.05,19.77) v1(47.05,20.61) v1(47.05,21.39) v1(47.05,22.31) v1(47.69,22.95) 48.19,23.45 v1(49.53,23.45) v1(50.65,23.45) v1(51.69,23.45) v1(52.92,23.45) v1(54.21,23.45) v1(55.57,23.45) v1(56.78,23.45) v1(57.95,23.45) v1(58.61,22.79) v1(59.15,22.25) v1(59.15,21.34) v1(59.15,20.43) v1(59.15,19.2) 58.19,18.23 v1(57.79,18.23) 57.48,18.23 v1(56.94,17.7) 56.32,17.07 C5.1 55.95,17.06 v1(55.95,15.61) v1(55.4,15.06) 55.14,14.8 v1(54.36,14.8) 53.87,14.8 v1(53.39,14.32) C20.1 53.47,13.37 v1(53.47,12.21) v1(53.47,11.09) v1(53.47,9.92) v1(52.89,9.34) v1(51.9,9.34) v1(51.06,9.34) v1(50.1,9.34) v1(49.03,9.34) 48.5,9.34 v1(48.26,9.58) 48.02,9.82 v1(48.02,10.57) v1(48.02,11.52) v1(48.02,12.42) 48.02,13.29 C19.1 47.83,13.78 v1(46.91,13.78)
  vias: v1(1.63,11.1) v1(1.63,10.08) v1(2.63,11.09) v1(2.62,10.08) v1(4.91,22.08) v1(4.91,19.89) v1(8.09,35.56) v1(8.09,34.54) v1(8.18,27.8) v1(8.18,26.77) v1(9.09,35.55) v1(9.07,34.54) v1(9.17,27.79) v1(9.16,26.77) v1(23.78,9.61) v1(23.76,7.67) v1(25.46,20.69) v1(25.46,19.67) v1(26.45,19.67) v1(26.46,20.68) v1(29.5,5.48) v1(29.5,4.46) v1(30.5,5.48) v1(30.49,4.46) v1(30.77,28.61) v1(30.77,27.59) v1(31.76,28.6) v1(31.75,27.59) v1(38.67,18.21) v1(38.67,17.19) v1(39.02,21.36) v1(39.64,7.51) v1(39.66,18.21) v1(39.65,17.19) v1(48.4,23.45) v1(53.82,5.88) v1(53.82,4.86) v1(54.82,5.88) v1(54.8,4.86) v1(55.12,32.71) v1(55.12,31.69) v1(56.12,32.7) v1(56.1,31.69) v1(58.63,18.65) v1(61.59,8.22) v1(62.39,21.09) v1(62.39,20.07) v1(63.39,21.08) v1(63.37,20.07) v1(66.33,32.59) v1(66.33,31.57) v1(67.33,32.59) v1(67.32,31.57) v1(67.39,13.92) v1(67.39,12.9) v1(68.38,13.91) v1(68.37,12.9) v1(72.24,24.14) v1(72.24,23.12) v1(73.23,24.13) v1(73.22,23.12) v1(74.69,32.53) v1(74.69,31.51) v1(75.68,32.53) v1(75.67,31.51) v1(75.91,4.07) v1(75.91,3.05) v1(76.91,4.06) v1(76.9,3.05) v1(79.79,8.22) v1(80.69,23.92) v1(80.69,22.9) v1(81.69,23.91) v1(81.68,22.9)
VCC: length 309
  Top Layer w0.254: 35.71,20.67 35.71,22.98 U1.32 35.31,23.42 C2.2 ; 35.71,20.67 35.71,20.68 42.23,20.68 ; 35.71,20.67 35.71,13.52 35.73,13.5 ; 35.73,13.5 U1.1 ; 35.73,13.5 U1.48 33.73,12.07 C1.2 ; C4.2 43.46,11.27 U1.64 ; 42.23,20.68 U1.19 ; 42.23,20.68 43.61,20.68 43.62,20.69 ; 43.62,20.69 43.62,21.15 44.72,22.25 C3.2 ; 43.62,20.69 43.62,19.72 43.84,19.5 U1.13 ; 45.23,11.27 45.23,11.2 45.09,11.06
  Top Layer w0.508: 34.47,2.03 SW3.1 ; U4.10 74.53,10.96 74.11,10.53 R29.2 64.28,10.53 v1(63.86,10.95) 63.86,17.4 64.17,17.71 67.94,17.71 R12.1 ; 40.75,1.78 3.43,1.78 3.16,2.04 H2.1 ; 40.75,1.78 67.27,1.78 67.77,2.28 R30.2 ; 40.75,1.78 40.69,1.83 R1.2 40.69,7.84 41.2,8.35 44.37,8.35 45.09,9.07 45.09,11.06 ; v1(28.19,43.89) 28.21,43.87 LED1.2 32.45,42.86 LED2.2 74.9,42.85 75.36,42.39 BUZ1.1 ; C2.2 21.53,23.42 21.15,23.03 21.15,15.23 20.8,14.88 v1(17.41,14.88) 17.41,12.09 17.41,12.08 ; v1(63.86,1.83) 63.86,1.78
  Bottom Layer w0.508: v1(13.46,37.28) v1(13.46,38.14) 13.46,43.51 13.84,43.89 28.19,43.89 v1(28.19,43.89) ; v1(13.57,30.27) v1(13.57,29.52) 13.57,15.27 13.97,14.88 v1(17.41,14.88) 17.41,12.09 17.41,12.08 17.41,9.47 16.82,8.89 3.54,8.89 3.16,8.51 H2.1 ; v1(63.86,10.95) 63.86,1.84 v1(63.86,1.83)
BAT+: length 27.6
  Top Layer w0.508: R10.2 37.56,41.9 37.14,41.48 BT3.1
BAT-: length 4.3
  Top Layer w0.508: 56.99,37.79 53.46,37.79 BT3.2
BLK: length 25.5
  Top Layer w0.254: R14.1 40.06,26.03 39.73,25.7 U1.24
BOOT0: length 12
  Top Layer w0.254: R2.2 38.29,3.17 38.54,3.41 SW3.2 38.59,6.05 38.59,8.82 38.81,9.03 40.98,9.03 41.23,9.28 U1.60
BOOT1: length 2.3
  Top Layer w0.254: U1.28 37.73,25.19 R3.2
BUZ: length 56.5
  Top Layer w0.254: R18.1 70.96,29.64 70.51,29.19 37.25,29.19 v1(37.23,29.16) ; v1(37.23,12.87) 37.23,11.5 U1.52
  Bottom Layer w0.254: v1(37.23,29.16) v1(37.23,12.87)
CS: length 52.4
  Top Layer w0.254: 41.87,27.09 41.75,27.09 ; 41.87,27.09 41.99,27.22 76.3,27.22 76.63,26.89 U4.7 ; 41.87,27.09 v1(41.89,27.07) ; v1(41.87,24.45) 41.73,24.31 U1.20
  Bottom Layer w0.254: v1(41.89,27.07) 41.91,27.05 41.91,24.49 v1(41.87,24.45)
D1/D2: length 2.7
  Top Layer w0.508: Q5.2 Q5.5
DP+: length 14.5
  Top Layer w0.254: USB2.A6 5.68,21.25 5.56,21.13 5.56,20.39 5.73,20.22 6.45,20.22 USB2.B6 15.79,20.25 16,20.04 16,19.55 15.57,19.12 U5.5
DP-: length 14.4
  Top Layer w0.254: 7.36,20.74 7.36,21.58 7.19,21.75 USB2.B7 ; 7.36,20.74 15.96,20.74 16.41,20.29 16.41,19.55 16.84,19.12 U5.6 ; 7.36,20.74 6.49,20.74 USB2.A7
LED_K: length 12
  Top Layer w0.254: 67.94,20.08 73.5,20.08 73.83,19.74 U4.11
NRST: length 20.1
  Top Layer w0.254: 42.12,5.94 SW4.2 ; 42.12,5.94 42.2,5.86 R1.1 45.56,3.05 C7.2 ; 42.12,5.94 v1(43.52,5.94) ; U1.7 v1(43.6,16.5)
  Bottom Layer w0.254: v1(43.52,5.94) 43.6,6.02 v1(43.6,16.5)
OSC32_IN: length 7.8
  Top Layer w0.254: X2.1 49.57,11.43 C19.2 49.59,13.46 49.59,14.27 49.36,14.5 U1.3
OSC32_OUT: length 10.6
  Top Layer w0.254: U1.4 51.79,15 52.01,14.78 52.01,13.47 C20.2 52.13,13.31 X2.2
OSC_IN: length 14.8
  Top Layer w0.254: X1.1 55.48,20.33 54.54,19.4 54.54,15.72 54.3,15.47 46.51,15.47 46.48,15.5 U1.5
OSC_OUT: length 11.7
  Top Layer w0.254: U1.6 51.68,16 51.87,16.19 C6.2 51.87,19.42 X1.2
PA9: length 53.9
  Top Layer w0.254: U1.42 33.69,16.55 25.26,16.55 v1(25.17,16.64) ; H2.3 8.24,5.19 8.24,14 8.49,14.25 12.71,14.25 13.03,14.57 U5.3
  Bottom Layer w0.254: v1(25.17,16.64) 25.17,12.22 25.03,12.08 25.03,6.85 24.76,6.58 8.45,6.58 8.24,6.37 H2.3
PA10: length 56.8
  Top Layer w0.254: H2.2 5.7,14.43 5.96,14.69 11.47,14.69 11.76,14.98 U5.2 ; U1.43 v1(22.54,16)
  Bottom Layer w0.254: H2.2 6.1,5.58 6.1,6.76 6.35,7.02 22.19,7.02 22.49,7.31 22.49,14.09 22.54,14.14 v1(22.54,16)
PC13: length 40.8
  Top Layer w0.254: U1.2 41.19,14 v1(41.02,14.17) ; v1(28.14,36.71) 28.14,38.03 R4.2
  Bottom Layer w0.254: v1(28.14,36.71) 40.59,36.71 41.05,36.25 41.05,14.2 v1(41.02,14.17)
RES: length 56.8
  Top Layer w0.254: U1.25 39.23,27.59 39.54,27.89 77.03,27.89 77.33,27.59 U4.6
RS: length 55
  Top Layer w0.254: v1(43.27,28.55) 43.33,28.61 77.71,28.61 78.03,28.28 U4.5 ; v1(43.22,24.41) 43.23,24.4 U1.17
  Bottom Layer w0.254: v1(43.22,24.41) 43.27,24.45 43.27,28.55 v1(43.27,28.55)
SCL: length 73.2
  Top Layer w0.254: U1.21 41.23,24.81 41.52,25.1 59.37,25.1 59.94,24.53 59.94,7.62 60.28,7.28 R30.1 68.46,7.28 68.49,7.31 81.38,7.31 81.73,7.67 81.73,15.72 81.41,16.05 79.02,16.05 78.73,15.76 U4.4
SDA: length 62
  Top Layer w0.254: U1.23 40.23,25.23 40.53,25.53 59.8,25.53 60.37,24.96 60.37,9.35 60.7,9.02 R29.1 79.01,9.02 79.43,9.44 U4.3
SWCLK: length 15.2
  Top Layer w0.254: U1.49 35.73,9.67 35.45,9.39 25.25,9.39 25.03,9.61 25.03,12.08
SWDIO: length 19.2
  Top Layer w0.254: U1.50 36.19,11.46 36.19,9.14 35.93,8.89 22.74,8.89 22.49,9.14 22.49,12.08
$1N3244: length 1.7
  Top Layer w0.508: R4.1 28.22,39.62 LED1.1
$1N3260: length 1.8
  Top Layer w0.508: LED2.1 32.47,39.5 R5.1
$1N3280: length 4.6
  Top Layer w0.508: Q1.2 63.33,36.82 63.58,36.57 63.58,33.44 63.54,33.41
$1N3281: length 10.3
  Top Layer w0.508: R10.1 63.03,40.39 C14.1 65.88,40.42 66.17,40.12 66.17,37.09 65.91,36.82 Q1.5
$1N3299: length 7.5
  Top Layer w0.254: U4.12 73.13,16 72.86,16.28 68.01,16.28
$1N3320: length 2
  Top Layer w0.254: R13.1 66.08,20.14 66.08,22.03
$1N3321: length 4.9
  Top Layer w0.254: Q4.1 66.99,25.98 R15.2 66.94,26.03 R14.2
$1N3342: length 2.3
  Top Layer w0.254: 14.32,15.71 14.32,17.98 U5.4
$1N3364: length 1.7
  Top Layer w0.508: U11.2 24.28,26.88 24.14,26.74
$1N3367: length 7.6
  Top Layer w0.508: 24.28,34.24 24.28,35.65 23.78,36.15 20.3,36.15 20.02,36.42 20.02,38.01
$1N3368: length 1.8
  Top Layer w0.508: LED6.1 20.02,41.34 R27.2
$1N3369: length 1.8
  Top Layer w0.508: R28.2 24.01,39.62 LED7.1
$1N3370: length 5.2
  Top Layer w0.508: 25.55,34.24 25.55,37.61 25.2,37.96 24.03,37.96 R28.1
$1N3387: length 2.6
  Top Layer w0.508: 59.69,37.79 62.22,37.79 62.3,37.71
$1N3388: length 2.6
  Top Layer w0.508: 62.3,35.81 62.22,35.89 Q5.4
$1N22463: length 5.1
  Top Layer w0.254: R18.2 69.42,34.6 R19.1 69.42,39.38 Q6.2
$1N22485: length 15
  Top Layer w0.254: BUZ1.2 81.44,38.59 81.44,37.26 81.21,37.03 73.19,37.03 72.96,37.25 72.96,40.24 72.68,40.53 Q6.3

## Copper pours and planes (outline as drawn; the poured copper is in the pictures)
+5V on Top Layer: 2.94,42.12 11.8,42.12 11.8,31.11 2.94,31.11
+5V on Top Layer: 2.95,31.28 10.76,31.28 10.76,18.33 2.95,18.33
GND on Top Layer: -3.82,47.62 87.03,47.62 87.47,47.18 87.47,-3.92 86.58,-4.82 -4.87,-4.82 -4.87,46.58
GND on Bottom Layer: -3.89,46.61 86.36,46.61 88.15,44.82 88.15,-2.25 87.85,-2.54 -3.14,-2.54 -3.89,-1.8
VCC on Top Layer: 11.64,42.13 15.31,42.13 15.31,28.97 11.64,28.97
BAT+ on Top Layer: 26.5,39.05 39.31,39.05 39.31,33.57 26.5,33.57

## Text on the board
Top Silkscreen Layer: VCC | A10 | A9 | GND
